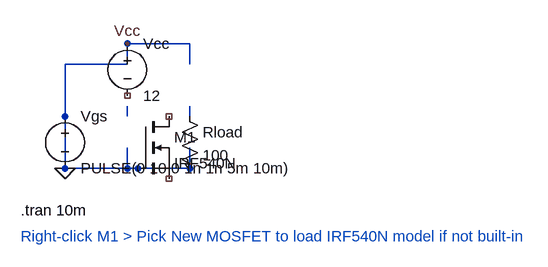
[diagram p0: schematic 11_MOSFET_switch.asc]
11_MOSFET_switch.asc, the LTspice schematic file:
Version 4
SHEET 1 880 680
WIRE 320 96 320 64
WIRE 320 64 224 64
WIRE 224 64 224 96
WIRE 320 176 320 160
WIRE 224 176 224 160
WIRE 224 256 224 224
WIRE 320 256 320 224
WIRE 320 256 224 256
WIRE 128 176 128 96
WIRE 128 96 224 96
WIRE 128 256 128 176
WIRE 128 256 224 256
FLAG 128 256 0
FLAG 224 64 Vcc
SYMBOL voltage 128 160 R0
SYMATTR InstName Vgs
SYMATTR Value PULSE(0 10 0 1n 1n 5m 10m)
SYMBOL voltage 224 48 R0
SYMATTR InstName Vcc
SYMATTR Value 12
SYMBOL res 304 160 R0
SYMATTR InstName Rload
SYMATTR Value 100
SYMBOL nmos 240 176 R0
SYMATTR InstName M1
SYMATTR Value IRF540N
TEXT 60 320 Left 2 !.tran 10m
TEXT 60 360 Left 2 ;Right-click M1 > Pick New MOSFET to load IRF540N model if not built-in

The netlist it stands for:
* 11_MOSFET_switch.asc
Vgs 0 0 PULSE(0 10 0 1n 1n 5m 10m)
Vcc 0 NC_01 12
Rload N001 0 100
M1 NC_02 0 NC_03 NC_03 IRF540N
.model NMOS NMOS
.model PMOS PMOS
.lib standard.mos
.tran 10m
* Right-click M1 > Pick New MOSFET to load IRF540N model if not built-in
.backanno
.end